# EAGLE schematic test1 (EAGLE 8.2.2)
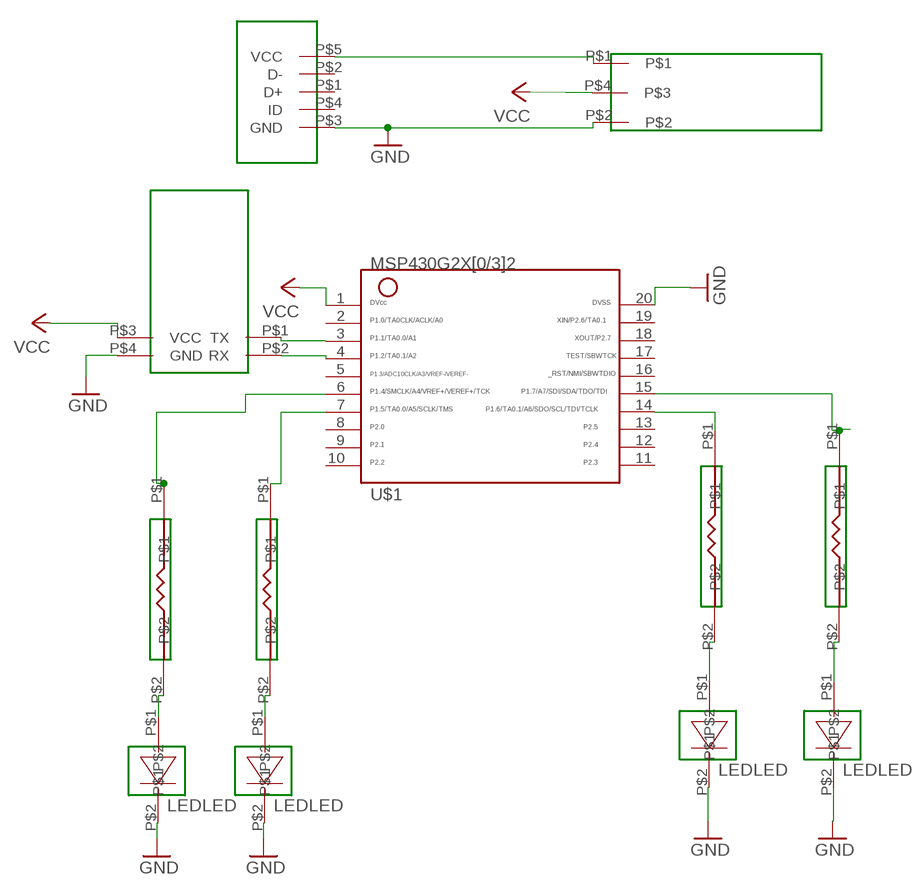
[diagram p0: schematic, sheet 1]

## Parts
U$1  MSP430G553MSP430G2553  [MSP430G553]
U$2  RN41RN41  [RN41]
U$3  USBUSB  [USB]
U$4  LEDLED  [LED]
U$5  LEDLED  [LED]
U$6  LEDLED  [LED]
U$7  LEDLED  [LED]
U$8  LMC3V3LMC3V3  [LMC3V3]
U$9  1KOHM1KOHM  [1KOHM]
U$10  1KOHM1KOHM  [1KOHM]
U$11  1KOHM1KOHM  [1KOHM]
U$12  1KOHM1KOHM  [1KOHM]

## Nets
GND: U$1.20 U$2.P$4(GND) U$3.P$3(GND) U$4.P$2 U$5.P$2 U$6.P$2 U$7.P$2 U$8.P$2
N$2: U$3.P$5(VCC) U$8.P$1
N$3: U$1.6 U$9.P$1
N$4: U$1.7 U$10.P$1
N$5: U$1.14 U$11.P$1
N$6: U$1.15 U$12.P$1
N$7: U$6.P$1 U$11.P$2
N$8: U$7.P$1 U$12.P$2
N$9: U$1.4 U$2.P$2(RX)
N$10: U$1.3 U$2.P$1(TX)
N$11: U$4.P$1 U$9.P$2
N$12: U$5.P$1 U$10.P$2
VCC: U$1.1 U$2.P$3(VCC) U$8.P$4
Unconnected: U$1.2 U$1.5 U$1.8 U$1.9 U$1.10 U$1.11 U$1.12 U$1.13 U$1.16 U$1.17 U$1.18 U$1.19 U$3.P$1(D+) U$3.P$2(D-) U$3.P$4(ID)

## Library data of the parts
U$1 = clouddemo:MSP430G553; CNT: 0; HEIGHT: 20
U$2 = clouddemo:RN41; CNT: 0; HEIGHT: 0.7
U$3 = clouddemo:USB; CNT: 1; HEIGHT: 15.00
U$4-U$7 = clouddemo:LED; CNT: 1; HEIGHT: 15
U$8 = clouddemo:LMC3V3; CNT: 0; HEIGHT: 25
U$9-U$12 = clouddemo:1KOHM; CNT: 0; HEIGHT: 10